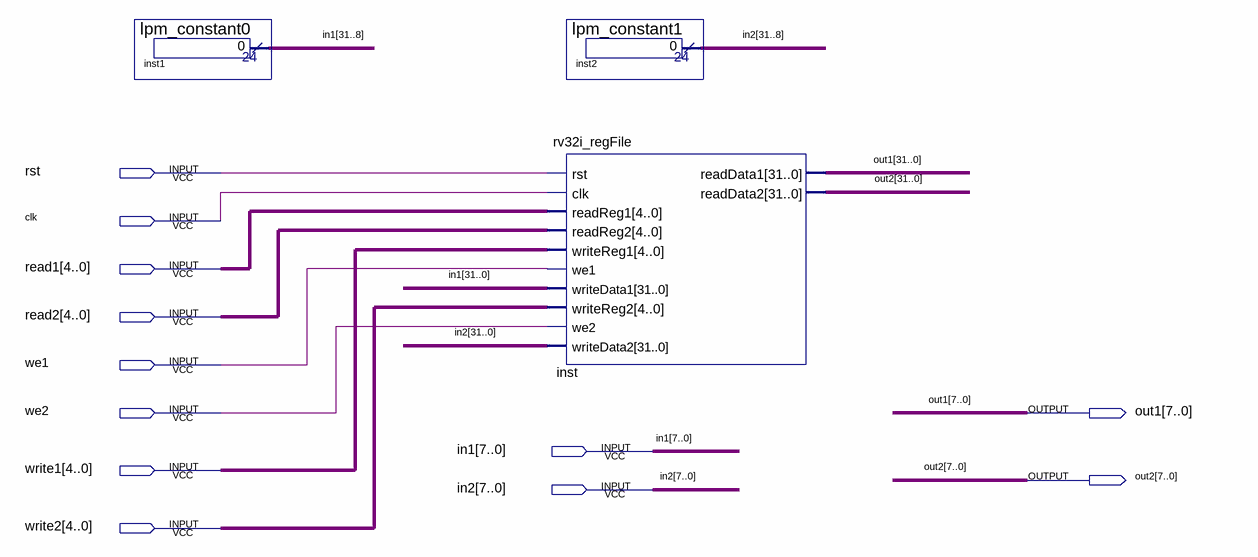
[diagram p0: schematic sheet]
// Quartus schematic rv32i_regFile_tester.bdf as structural Verilog: 3 symbols, 12 pins
module rv32i_regFile_tester (
  input  rst,
  input  clk,
  input  [4:0] read1,
  input  [4:0] read2,
  input  we1,
  input  we2,
  input  [31:0] in1,
  input  [4:0] write1,
  input  [31:0] in2,
  input  [4:0] write2,
  output [31:0] out1,
  output [31:0] out2
);

  lpm_constant0 inst1 (.result(in1[31:8]));
  lpm_constant1 inst2 (.result(in2[31:8]));
  rv32i_regFile inst (
    .rst(rst), .clk(clk), .readReg1(read1), .readReg2(read2), .writeReg1(write1), .we1(we1),
    .writeData1(in1), .writeReg2(write2), .we2(we2), .writeData2(in2), .readData1(out1), .readData2(out2));
endmodule
